# Altium schematic sheet control.SchDoc
size A; SheetNumber: 1; SheetTotal: 1
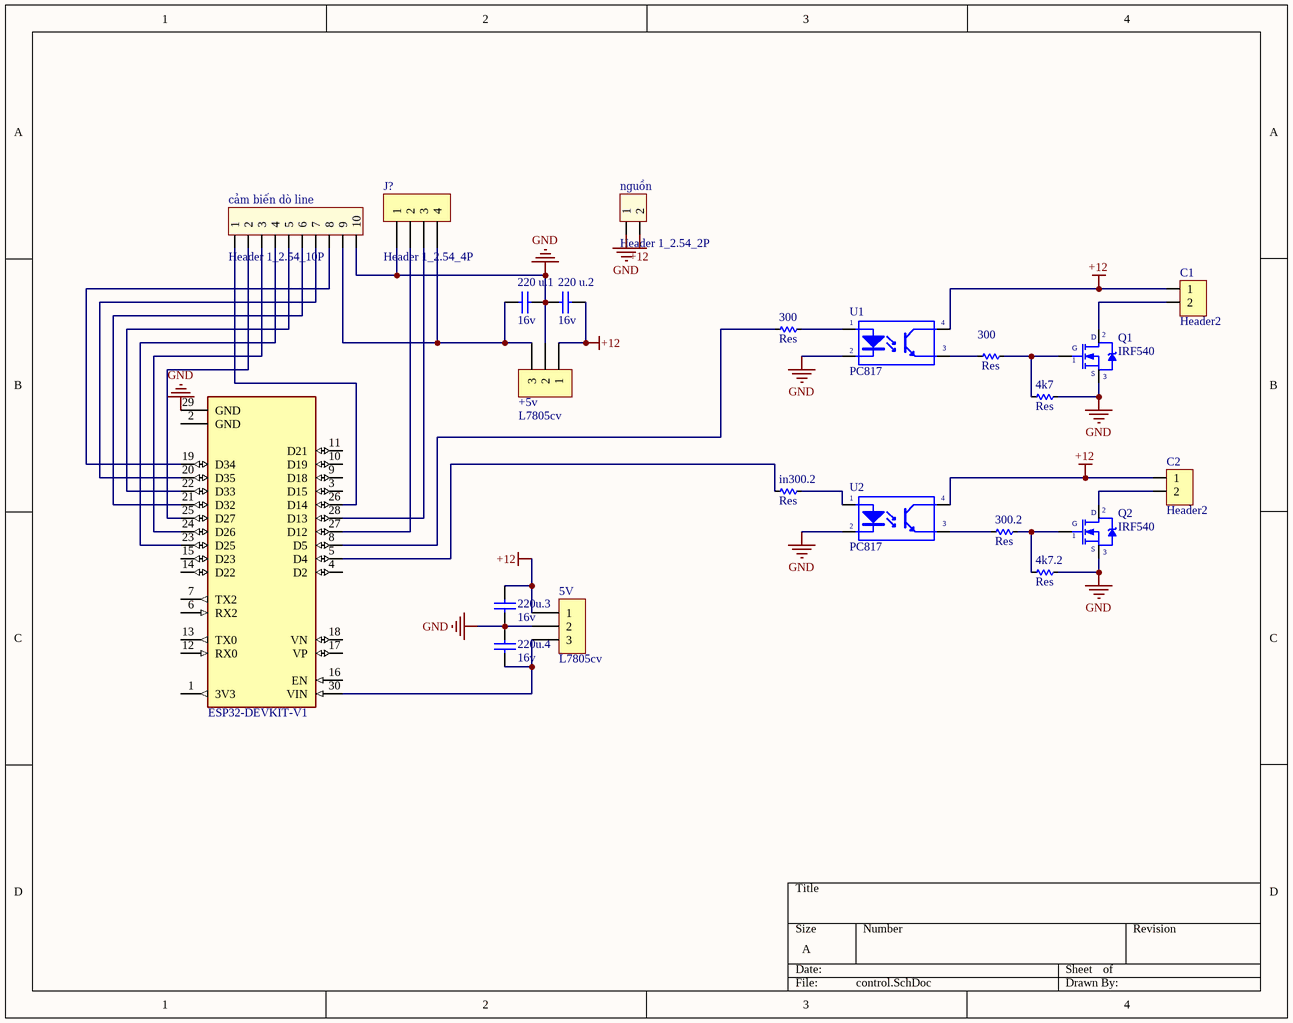
[diagram p0: control.SchDoc]

## Parts
(Parts that share a designator on the sheet are numbered #1, #2 ... from top to bottom, then left to right.)
4k7  Res  [RES-1/2W]
4k7.2  Res  [RES-1/2W]
5V  L7805cv  [Header_Duc Cong_3P 2.54]
220_u.1  16v  [CAP102 2KV]
220_u.2  16v  [CAP102 2KV]
220u.3  16v  [CAP102 2KV]
220u.4  16v  [CAP102 2KV]
300#1  Res  [RES-1/2W]
300#2  Res  [RES-1/2W]
300.2  Res  [RES-1/2W]
+5v  L7805cv  [Header_Duc Cong_3P 2.54]
?  ESP32-DEVKIT-V1  [MODULE_ESP32_DEVKIT_V1]
C1  Header2  [HDR2]
C2  Header2  [HDR2]
cảm_biến_dò_line  Header 1_2.54_10P  [Header_Duc Thang_10P_2.54]
in300.2  Res  [RES-1/2W]
J?  Header 1_2.54_4P  [Header_Duc Cong_4P 2.54]
nguồn  Header 1_2.54_2P  [Header_Duc Cong_2P 2.54]
Q1  IRF540  [TO220H1]
Q2  IRF540  [TO220H1]
U1  PC817  [DIP4]
U2  PC817  [DIP4]

## Nets
+12: 5V.1 220_u.2.1 220u.3.1 +5v.1 C1.1 C2.1 nguồn.2 U1.4(C) U2.4(C)
GND: 4k7.2 4k7.2.2 5V.2 220_u.1.1 220_u.2.2 220u.3.2 220u.4.1 +5v.2 ?.29(GND) cảm_biến_dò_line.10 J?.1 nguồn.1 Q1.3(S) Q2.3(S) U1.2(K) U2.2(K)
Net4k7.2_1: 4k7.2.1 300.2.1 Q2.1(G)
Net4k7_1: 4k7.1 300#2.1 Q1.1(G)
Net5V_3: 5V.3 220u.4.2 ?.30(VIN)
Net220_u.1_2: 220_u.1.2 +5v.3 cảm_biến_dò_line.9 J?.4
Net300#1_1: 300#1.1 ?.8(D5)
Net300#1_2: 300#1.2 U1.1(A)
Net300#2_2: 300#2.2 U1.3(E)
Net300.2_2: 300.2.2 U2.3(E)
Net?_5: ?.5(D4) in300.2.1
Net?_19: ?.19(D34) cảm_biến_dò_line.8
Net?_20: ?.20(D35) cảm_biến_dò_line.7
Net?_21: ?.21(D32) cảm_biến_dò_line.6
Net?_22: ?.22(D33) cảm_biến_dò_line.5
Net?_23: ?.23(D25) cảm_biến_dò_line.4
Net?_24: ?.24(D26) cảm_biến_dò_line.3
Net?_25: ?.25(D27) cảm_biến_dò_line.2
Net?_26: ?.26(D14) cảm_biến_dò_line.1
Net?_27: ?.27(D12) J?.2
Net?_28: ?.28(D13) J?.3
NetC1_2: C1.2 Q1.2(D)
NetC2_2: C2.2 Q2.2(D)
Netin300.2_2: in300.2.2 U2.1(A)

Not connected (* = marked no-connect by the designer): ? 1(3V3) 2(GND) 3(D15) 4(D2) 6(RX2) 7(TX2) 9(D18) 10(D19) 11(D21) 12(RX0) 13(TX0) 14(D22) 15(D23) 16(EN) 17(VP) 18(VN)

## Library data of the parts
4k7 4k7.2 300#1 300#2 300.2 in300.2 = Res: Manufacturer: Generic Components; Class: Passive; SubClass: R; Published: 08/06/2000; Publisher: Altium Hobart Technology Centre
5V +5v = Header 1_2.54_3P: Cắm; Ma_Hang: *; Ghi_Chu: *; Don_Vi: *; Kieu_Chan: *; Chung_Loai: Cắm
220_u.1 220_u.2 220u.3 220u.4 = Tu 102 2KV: Cắm; Value: Tụ Cao Áp 102 2KV
? = ESP32-DEVKIT-V1: Dual core, Wi-Fi: 2.4 GHz up to 150 Mbits/s,BLE (Bluetooth Low Energy) and legacy Bluetooth, 32 bits, Up to 240 MHz; MF: Do it; Price: None; Availability: Not in stock; Package: None; MP: ESP32-DEVKIT-V1; Value: *; SnapEDA_Link: https://www.snapeda.com/parts/ESP32-DEVKIT-V1/Do+it/view-part/?ref=snap; Check_prices: https://www.snapeda.com/parts/ESP32-DEVKIT-V1/Do+it/view-part/?ref=eda
C1 C2 = Header2: Header IDC, 2 x 1 Pin Vertical 2.54mm Pitch (Non-Boxed, Male); Manufacturer: W¨¹rth Elektronik eiSos GmbH; partNo: 613002143121; ComponentLink1 Description: Manufacturer; ComponentLink2 Description: Datasheet; NoPins: 02; Created Date: 29 March 2013; ComponentLink1URL: http://www.we-online.com; ComponentLink2URL: http://katalog.we-online.de/em/datasheet/6130xx143121.pdf; Created by: Karrer Zheng
cảm_biến_dò_line = Header 1_2.54_10P: Cắm; Don_Vi: Con; Chung_Loai: Cắm
J? = Header 1_2.54_4P: Cắm; Chung_Loai: Cắm
nguồn = Header 1_2.54_2P: Cắm; Chung_Loai: Cắm
Q1 Q2 = IRF840: MOSFET N - CHANNEL 500V - 0.75 - 8A - TO-220; Value: IRF840
U1 U2 = PC817: Single Opto; Value: PC817